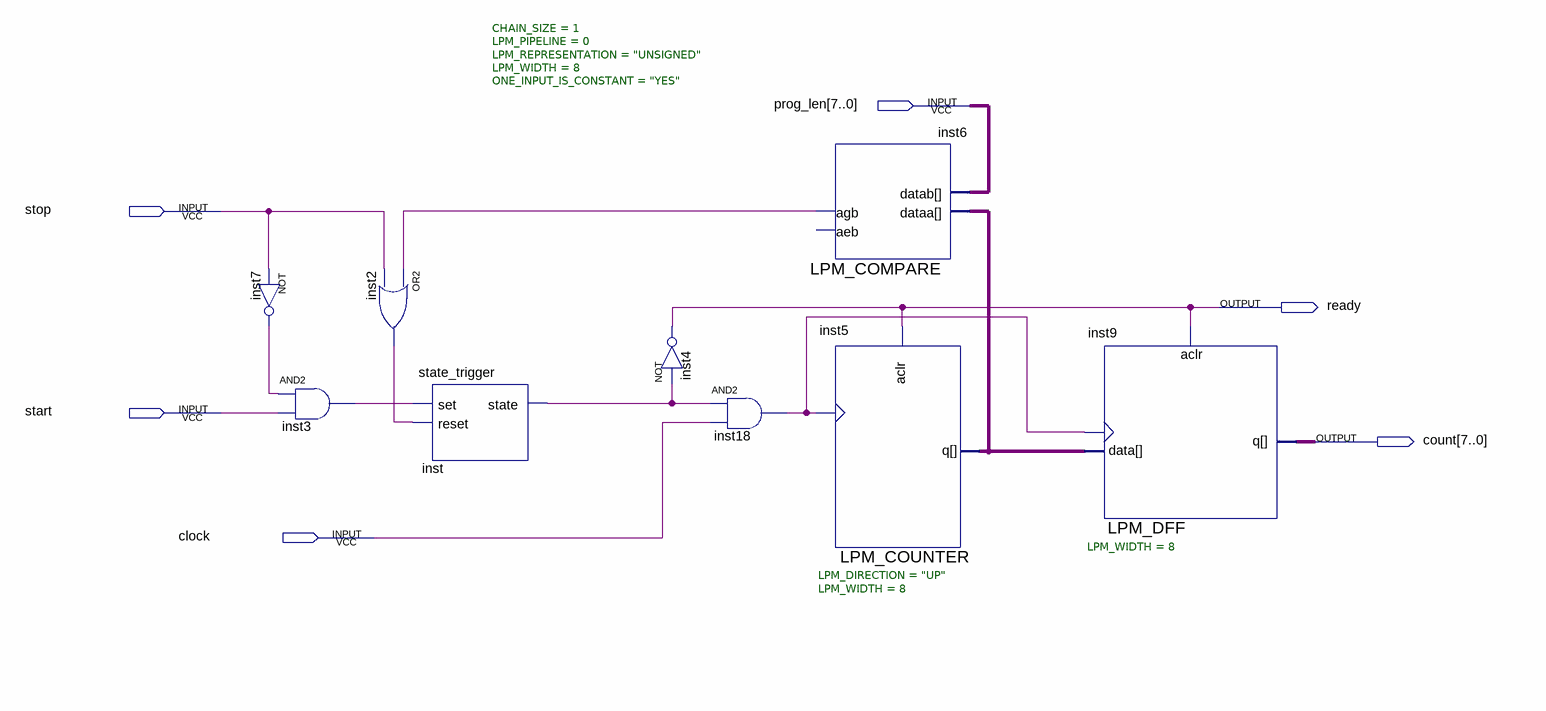
[diagram p0: schematic sheet]
// Quartus schematic stop_iterator.bdf as structural Verilog: 9 symbols, 6 pins
module stop_iterator (
  input  [7:0] prog_len,
  input  stop,
  input  start,
  input  clock,
  output ready,
  output [7:0] count
);

  wire inst2_out, inst3_out, inst6_agb, inst7_out, inst18_out, inst_state;
  wire [7:0] inst5_q;

  not inst7 (inst7_out, stop);
  and inst3 (inst3_out, inst7_out, start);
  or inst2 (inst2_out, inst6_agb, stop);
  state_trigger inst (.set(inst3_out), .reset(inst2_out), .state(inst_state));
  not inst4 (ready, inst_state);
  and inst18 (inst18_out, inst_state, clock);
  LPM_COMPARE #(.CHAIN_SIZE(1), .LPM_PIPELINE(0), .LPM_REPRESENTATION("UNSIGNED"), .LPM_WIDTH(8), .ONE_INPUT_IS_CONSTANT("YES")) inst6 (
    .dataa(inst5_q), .datab(prog_len), .agb(inst6_agb));  // open: aeb
  LPM_COUNTER #(.LPM_DIRECTION("UP"), .LPM_WIDTH(8)) inst5 (.clock(inst18_out), .aclr(ready), .q(inst5_q));
  LPM_DFF #(.LPM_WIDTH(8)) inst9 (.clock(inst18_out), .data(inst5_q), .aclr(ready), .q(count));
endmodule
